# Altium schematic sheet S7CAS-PLEIADES-CARTE-MERE_P07_LOW_POWER.SchDoc
size Tabloid; DocumentNumber: 3; SheetNumber: 3; SheetTotal: 16; Sheet_Name: LOW VALUE POWER; Size: 11x17
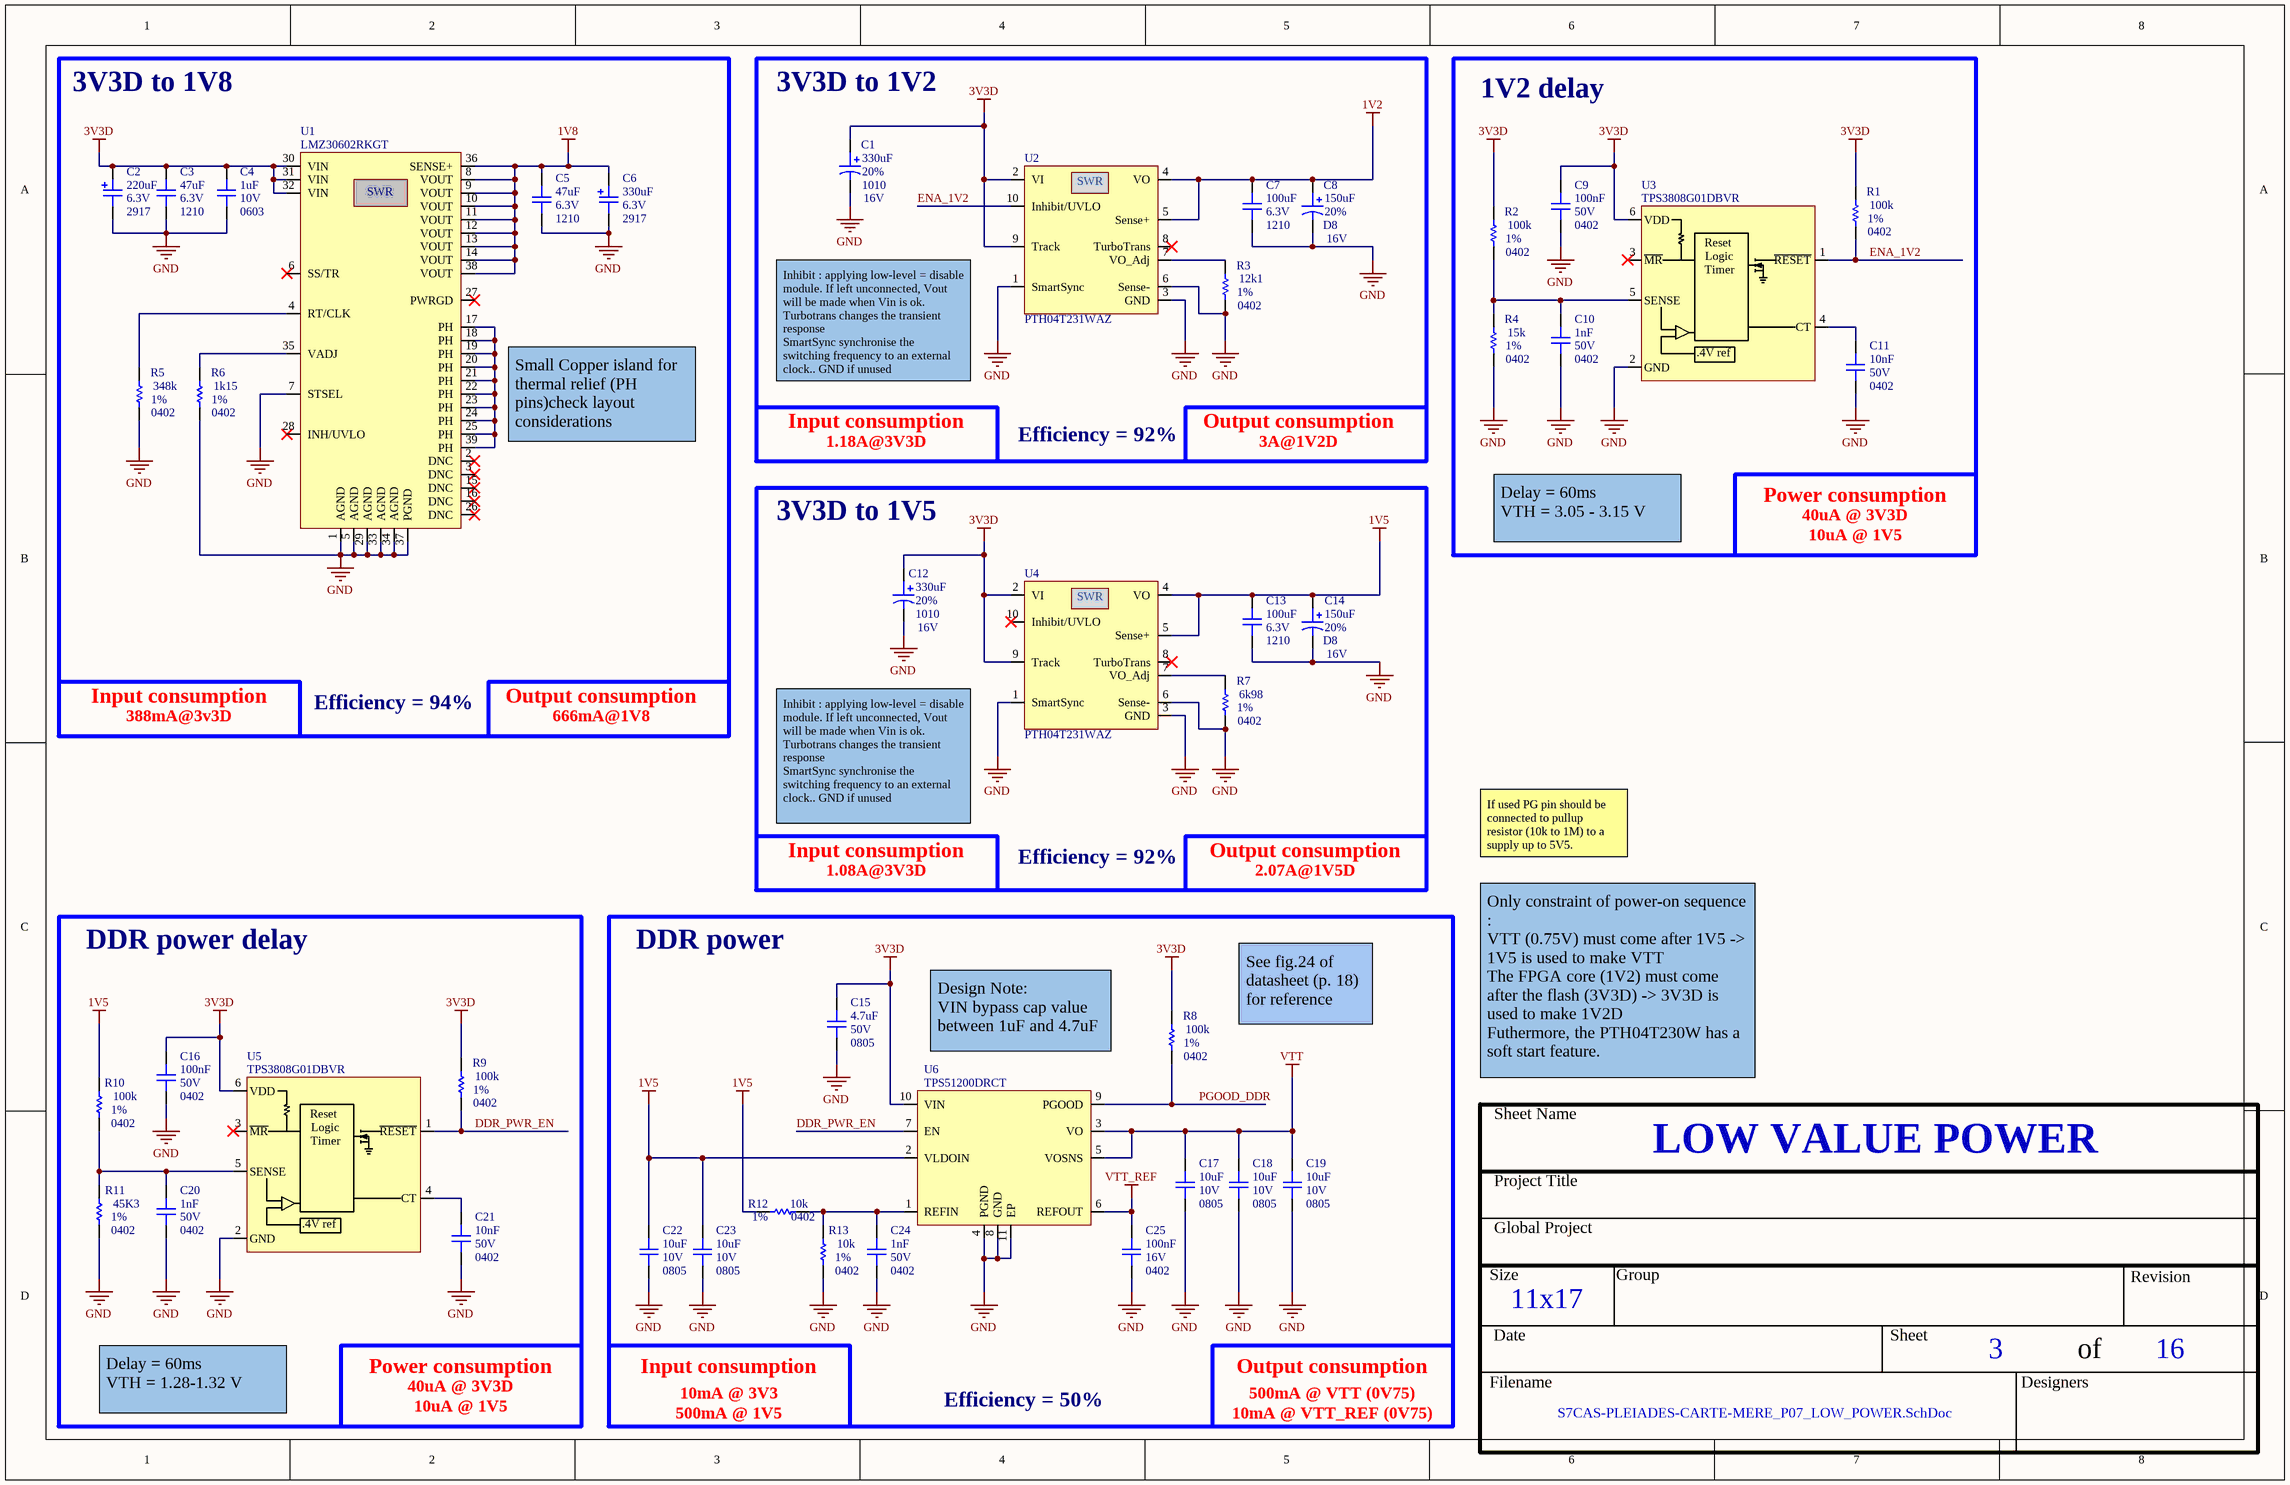
[diagram p0: S7CAS-PLEIADES-CARTE-MERE_P07_LOW_POWER.SchDoc]

## Parts
C1  value 330uF  Voltage: 16V  Package: 1010  Precision: 20%  [CAP_ALU_1010_vishay]  (hidden comment: MAL214699501E3)
C2  value 220uF  Voltage: 6.3V  Package: 2917  [CAP_TAN_2917(D)]  (hidden comment: CAP - TANTALUM - CASE D)
C3  value 47uF  Voltage: 6.3V  Package: 1210  [CAP_1210]  (hidden comment: CAP - 1210)
C4  value 1uF  Voltage: 10V  Package: 0603  [CAP_0603]  (hidden comment: CAP - 0603)
C5  value 47uF  Voltage: 6.3V  Package: 1210  [CAP_1210]  (hidden comment: CAP - 1210)
C6  value 330uF  Voltage: 6.3V  Package: 2917  [CAP_TAN_2917(D)]  (hidden comment: CAP - TANTALUM - CASE D)
C7  value 100uF  Voltage: 6.3V  Package: 1210  [CAP_1210]  (hidden comment: CAP - 1210)
C8  value 150uF  Voltage: 16V  Package: D8  Precision: 20%  [CAP_ALU_D8]  (hidden comment: EEE-FKC151XAP)
C9  value 100nF  Voltage: 50V  Package: 0402  [CAP_0402]  (hidden comment: CAP - 0402)
C10  value 1nF  Voltage: 50V  Package: 0402  [CAP_0402]  (hidden comment: CAP - 0402)
C11  value 10nF  Voltage: 50V  Package: 0402  [CAP_0402]  (hidden comment: CAP - 0402)
C12  value 330uF  Voltage: 16V  Package: 1010  Precision: 20%  [CAP_ALU_1010_vishay]  (hidden comment: MAL214699501E3)
C13  value 100uF  Voltage: 6.3V  Package: 1210  [CAP_1210]  (hidden comment: CAP - 1210)
C14  value 150uF  Voltage: 16V  Package: D8  Precision: 20%  [CAP_ALU_D8]  (hidden comment: EEE-FKC151XAP)
C15  value 4.7uF  Voltage: 50V  Package: 0805  [CAP_0805]  (hidden comment: CAP - 0805)
C16  value 100nF  Voltage: 50V  Package: 0402  [CAP_0402]  (hidden comment: CAP - 0402)
C17  value 10uF  Voltage: 10V  Package: 0805  [CAP_0805]  (hidden comment: CAP - 0805)
C18  value 10uF  Voltage: 10V  Package: 0805  [CAP_0805]  (hidden comment: CAP - 0805)
C19  value 10uF  Voltage: 10V  Package: 0805  [CAP_0805]  (hidden comment: CAP - 0805)
C20  value 1nF  Voltage: 50V  Package: 0402  [CAP_0402]  (hidden comment: CAP - 0402)
C21  value 10nF  Voltage: 50V  Package: 0402  [CAP_0402]  (hidden comment: CAP - 0402)
C22  value 10uF  Voltage: 10V  Package: 0805  [CAP_0805]  (hidden comment: CAP - 0805)
C23  value 10uF  Voltage: 10V  Package: 0805  [CAP_0805]  (hidden comment: CAP - 0805)
C24  value 1nF  Voltage: 50V  Package: 0402  [CAP_0402]  (hidden comment: CAP - 0402)
C25  value 100nF  Voltage: 16V  Package: 0402  [CAP_0402]  (hidden comment: CAP - 0402)
R1  value 100k  Package: 0402  Precision: 1%  [RES_0402]  (hidden comment: RES - 0402)
R2  value 100k  Package: 0402  Precision: 1%  [RES_0402]  (hidden comment: RES - 0402)
R3  value 12k1  Package: 0402  Precision: 1%  [RES_0402]  (hidden comment: RES - 0402)
R4  value 15k  Package: 0402  Precision: 1%  [RES_0402]  (hidden comment: RES - 0402)
R5  value 348k  Package: 0402  Precision: 1%  [RES_0402]  (hidden comment: RES - 0402)
R6  value 1k15  Package: 0402  Precision: 1%  [RES_0402]  (hidden comment: RES - 0402)
R7  value 6k98  Package: 0402  Precision: 1%  [RES_0402]  (hidden comment: RES - 0402)
R8  value 100k  Package: 0402  Precision: 1%  [RES_0402]  (hidden comment: RES - 0402)
R9  value 100k  Package: 0402  Precision: 1%  [RES_0402]  (hidden comment: RES - 0402)
R10  value 100k  Package: 0402  Precision: 1%  [RES_0402]  (hidden comment: RES - 0402)
R11  value 45K3  Package: 0402  Precision: 1%  [RES_0402]  (hidden comment: RES - 0402)
R12  value 10k  Package: 0402  Precision: 1%  [RES_0402]  (hidden comment: RES - 0402)
R13  value 10k  Package: 0402  Precision: 1%  [RES_0402]  (hidden comment: RES - 0402)
U1  LMZ30602RKGT  [REG_SWI_LMZ30606RKGT]
U2  PTH04T231WAZ  [REG_SWR_PTH04T231WAZ]
U3  TPS3808G01DBVR  [POW_TPS3808G01DBVR]
U4  PTH04T231WAZ  [REG_SWR_PTH04T231WAZ]
U5  TPS3808G01DBVR  [POW_TPS3808G01DBVR]
U6  TPS51200DRCT  [REG_PMIC_TPS51200DRCT]

## Blocks framed on the sheet
3V3D to 1V8: C2-C6 R5 R6 U1
3V3D to 1V2: C1 C7 C8 R3 U2
1V2 delay: C9-C11 R1 R2 R4 U3
3V3D to 1V5: C12-C14 R7 U4
DDR power delay: C16 C20 C21 R9-R11 U5
DDR power: C15 C17-C19 C22-C25 R8 R12 R13 U6

## Nets
1V2: C7.2 C8.1 U2.4(VO) U2.5(Sense+)
1V5: C13.2 C14.1 C22.2 C23.2 R10.2 R12.2 U4.4(VO) U4.5(Sense+) U6.2(VLDOIN)
1V8: C5.2 C6.1 U1.8(VOUT) U1.9(VOUT) U1.10(VOUT) U1.11(VOUT) U1.12(VOUT) U1.13(VOUT) U1.14(VOUT) U1.36(SENSE+) U1.38(VOUT)
3V3D: C1.1 C2.1 C3.2 C4.2 C9.2 C12.1 C15.2 C16.2 R1.2 R2.2 R8.2 R9.2 U1.30(VIN) U1.31(VIN) U1.32(VIN) U2.2(VI) U2.9(Track) U3.6(VDD) U4.2(VI) U4.9(Track) U5.6(VDD) U6.10(VIN)
GND: C1.2 C2.2 C3.1 C4.1 C5.1 C6.2 C7.1 C8.2 C9.1 C10.1 C11.1 C12.2 C13.1 C14.2 C15.1 C16.1 C17.1 C18.1 C19.1 C20.1 C21.1 C22.1 C23.1 C24.1 C25.1 R3.1 R4.1 R5.1 R6.1 R7.1 R11.1 R13.1 U1.1(AGND) U1.5(AGND) U1.7(STSEL) U1.29(AGND) U1.33(AGND) U1.34(AGND) U1.37(PGND) U2.1(SmartSync) U2.3(GND) U2.6(Sense-) U3.2(GND) U4.1(SmartSync) U4.3(GND) U4.6(Sense-) U5.2(GND) U6.4(PGND) U6.8(GND) U6.11(EP)
VTT: C17.2 C18.2 C19.2 U6.3(VO) U6.5(VOSNS)
VTT_REF: C25.2 U6.6(REFOUT)
DDR_PWR_EN: R9.1 U5.1(~{RESET}) U6.7(EN)
ENA_1V2: R1.1 U2.10(Inhibit/UVLO) U3.1(~{RESET})
PGOOD_DDR: R8.1 U6.9(PGOOD)
NetC10_2: C10.2 R2.1 R4.2 U3.5(SENSE)
NetC11_2: C11.2 U3.4(CT)
NetC20_2: C20.2 R10.1 R11.2 U5.5(SENSE)
NetC21_2: C21.2 U5.4(CT)
NetC24_2: C24.2 R12.1 R13.2 U6.1(REFIN)
NetR3_2: R3.2 U2.7(VO_Adj)
NetR5_2: R5.2 U1.4(RT/CLK)
NetR6_2: R6.2 U1.35(VADJ)
NetR7_2: R7.2 U4.7(VO_Adj)
NetU1_17: U1.17(PH) U1.18(PH) U1.19(PH) U1.20(PH) U1.21(PH) U1.22(PH) U1.23(PH) U1.24(PH) U1.25(PH) U1.39(PH)

Not connected (* = marked no-connect by the designer): U1 2(DNC)* 3(DNC)* 6(SS/TR)* 15(DNC)* 16(DNC)* 26(DNC)* 27(PWRGD)* 28(INH/UVLO)*; U2 8(TurboTrans)*; U3 3(~{MR})*; U4 8(TurboTrans)* 10(Inhibit/UVLO)*; U5 3(~{MR})*

## Notes on the sheet
- (near U1) Small Copper island for thermal relief (PH pins)check layout considerations
- Inhibit : applying low-level = disable module. If left unconnected, Vout will be made when Vin is ok.
  Turbotrans changes the transient response
  SmartSync synchronise the switching frequency to an external clock.. GND if unused
- 1.18A@3V3D
- Input consumption
- 3A@1V2D
- Output consumption
- Efficiency = 92%
- Power consumption
- Delay = 60ms
  VTH = 3.05 - 3.15 V
- 40uA @ 3V3D
- 10uA @ 1V5
- 388mA@3v3D
- Efficiency = 94%
- 666mA@1V8
- 1.08A@3V3D
- 2.07A@1V5D
- If used PG pin should be connected to pullup resistor (10k to 1M) to a supply up to 5V5.
- See fig.24 of datasheet (p. 18) for reference
- Design Note:
  VIN bypass cap value between 1uF and 4.7uF
- Only constraint of power-on sequence :
  VTT (0.75V) must come after 1V5 -> 1V5 is used to make VTT
  The FPGA core (1V2) must come after the flash (3V3D) -> 3V3D is used to make 1V2D
  Futhermore, the PTH04T230W has a soft start feature.
- Delay = 60ms
  VTH = 1.28-1.32 V
- 10mA @ 3V3
- 500mA @ 1V5
- Efficiency = 50%
- 500mA @ VTT (0V75)
- 10mA @ VTT_REF (0V75)
- Sheet Name
- Project Title
- Global Project
- Size
- Group
- Revision
- Date
- Sheet
- of
- Filename
- Designers
- (in symbol POW_TPS3808G01DBVR) Reset; Logic; Timer; .4V ref
- (in symbol REG_SWR_LMZ30602RKGT) SWR
- (in symbol REG_SWR_PTH04T231WAZ) SWR

## Library data of the parts
C1 C12 = CAP_ALU_MAL214699501E3: CAP - ALU 330uF 20% 16V - 1010; Current: 750mA; Mfg: Vishay Dale; Mfg Part Number: MAL214699501E3; HelpURL: http://www.vishay.com/docs/28403/146cti.pdf; CreatedBy: Jonathan Bouchard; Temperature: -55°C to 125°C; Power: *; Supplier 1: Digikey; Supplier Part Number 1: 4405PHCT-ND
C2 C6 = CAP_TANT_2917(D): CAP - TANTALUM - 2917; Precision: 10%; Current: *; CreatedBy: Jonathan Bouchard; Power: *
C3 C5 C7 C13 = CAP - 1210: Precision: 10%; Current: *; CreatedBy: Jonathan Bouchard; Power: *
C4 = CAP - 0603: Precision: 10%; Current: *; CreatedBy: Jonathan Bouchard; Power: *
C8 C14 = CAP_ALU_EEH-ZS1H151P: CAP ALUM 150UF 20% 16V SMD; Current: 1.3A; CreatedBy: Philippe; Temperature: -55°C ~ 105°C; Power: *; Supplier 1: Digi-Key; Supplier Part Number 1: PCE4401CT-ND
C9 C10 C16 C20 C24 = CAP - 0402: Mfg: C1005X7R1H102K050BA; Precision: 10%; Current: *; CreatedBy: Jonathan Bouchard; Power: *
C11 C21 = CAP - 0402: Precision: 10%; Current: *; CreatedBy: Jonathan Bouchard; Power: *
C15 = CAP - 0805: Precision: 10%; Current: *; CreatedBy: Jonathan Bouchard; Power: *
C17-C19 C22 C23 = CAP - 0805: Mfg: CL21B106KPQNNNE; Precision: 10%; Current: *; CreatedBy: Jonathan Bouchard; Power: *
C25 = CAP - 0402: Mfg Part Number: CL05B104KO5NNNC; Precision: 10%; Current: *; CreatedBy: Jonathan Bouchard; Power: *
R1-R13 = RES - 0402: Voltage: 50V; Power: 1/16W; Current: *; CreatedBy: Jonathan Bouchard
U1 = REG_SWR_LMZ30602RKGT: REG - DC DC Converter / Non-Isolated  Output 0.8 ~ 3.6V 2A 2.95V - 6V Input; Manufacturer #1: Texas Instruments; Value: 0.8-3.6V; Voltage Rating: 2.95-6V; Power Max: 7W; GRAMS Lib Spec: 2.8c; Magnetic Material: Unknown; Polarized: Yes; Tolerance: *; Current Rating: 2A; HelpURL: https://www.ti.com/lit/ds/symlink/lmz30602.pdf?ts=1612193535337&ref_url=https%253A%252F%252Fwww.ti.com%252Fproduct%252FLMZ30602%253Futm_source%253Dgoogle%2526utm_medium%253Dcpc%2526utm_campaign%253Dapp-null-null-GPN_EN-cpc-pf-google-wwe%2526utm_content%253DLMZ30602%2526ds_k%253DLMZ30602%2526DCM%253Dyes%2526gclid%253DCj0KCQiA6t6ABhDMARIsAONIYywbX5HTDjPcy63-ILCw60ouTSqFGPALMyLaft3c1Oc_UEXWX4eCDSkaAiF9EALw_wcB%2526gclsrc%253Daw.ds; CreatedBy/Date: Philippe Arsenault/2021-02-01; Temperature: -40°C ~ 85°C; Package: 39-BQFN Module; Manufacturer #2: *; Note: *; Assembly Type: SMD; Part Number #2: *; Part Number #1: LMZ30602RKGT; Cryo: UNKNOWN; Supplier 1: Digi-Key; Supplier Part Number 1: 296-37029-1-ND
U2 U4 = REG_SWR_PTH04T231WAZ: REG - MODULE PIP 6A 2.2V/5.5V - 10SMD; Manufacturer #1: Texas Instruments; Current Rating: 6A (out); Value: 0.69 - 3.6V (Out); Voltage rating: 2.2-5.5V (Input); Polarized: Yes; Magnetic Material: UNKNOWN; Manufacturer #2: *; Note: *; Power Max: *; Part Number #1: PTH04T231WAZ; Part Number #2: *; HelpURL: http://www.ti.com/lit/ds/symlink/pth04t231w.pdf; Supplier 1: Digi-Key; Assembly Type: SMD; Temperature: -40°C ~ 85°C; Supplier Part Number 1: 296-21792-ND; Package: SMD; CreatedBy/Date: Olivier Bernard / 6/5/2018; VerifiedBy: Caroline Paulin / 10 juillet 2018; Cryo: UNKNOWN
U3 U5 = POW_TPS3808G01DBVR: POW - Programmable-Delay  Voltage Supervisory adj - SOT-23-6; Manufacturer #1: Texas Instruments; GRAMS Lib Spec: 2.8; Magnetic Material: Unknown; Polarized: Yes; Value: *; Tolerance: *; Voltage Rating: *; Current Rating: *; Power Max: *; HelpURL: http://www.ti.com/lit/ds/symlink/tps3808.pdf; CreatedBy/Date: Joel Lemay 2018-11-13; VerifiedBy: Caroline Paulin - 22/11/2018; Temperature: -40°C ~ 125°C; Package: SOT-23-6; Manufacturer #2: *; Assembly Type: SMD; Part Number #2: *; Part Number #1: TPS3808G01DBVR; Supplier 1: Digi-Key; Supplier Part Number 1: 296-17188-1-ND; Cryo: UNKNOWN
U6 = REG_PMIC_TPS51200DRCT: REG - DDR TERMINATION/REF REG - 10-VFDFN; Manufacturer #1: Texas Instruments; Value: DDR, DDR2, DDR3(L), DDR4; Voltage Rating: 2.375V ~ 3.5V; Current Rating: Source: 3A~4.5A, Sink: 3.5A~5.5A; GRAMS Lib Spec: 2.8; Magnetic Material: Unknown; Polarized: Yes; Tolerance: *; Power Max: *; HelpURL: http://www.ti.com/lit/ds/symlink/tps51200.pdf; CreatedBy/Date: Joel Lemay 2019-03-19; VerifiedBy: Nicolas V. (2019-05-31); Temperature: -40°C ~ 85°C; Package: 10-VFDFN; Manufacturer #2: *; Note: *; Assembly Type: SMD; Part Number #2: *; Part Number #1: TPS51200DRCT; Supplier 1: Digi-Key; Supplier Part Number 1: 296-23830-1-ND; Cryo: UNKNOWN